# Altium project PSFB.PrjPcb (part 2 of 2)
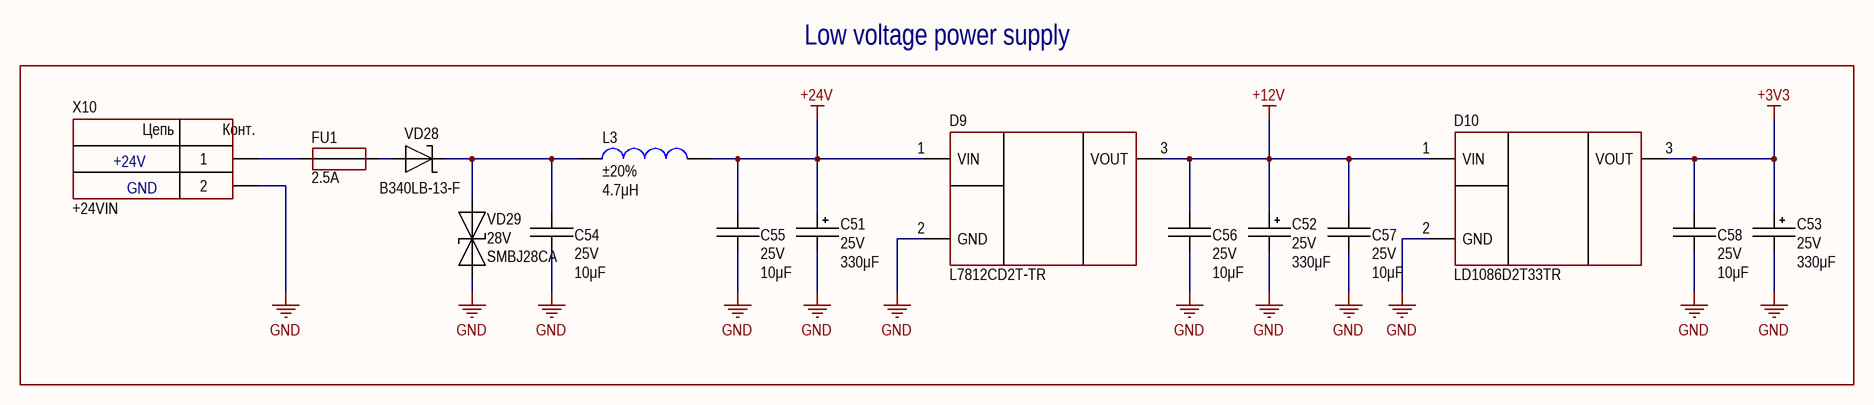
[diagram p6: PSFB_low_voltage_supply.SchDoc]

## Nets that join several sheets
+3V3: PSFB_bus_sense (C2.2 C3.2 D1.2 D2.8), M1 (5 pins), PSFB_low_voltage_supply (C53.1 C58.1 D10.3), M2 (5 pins), M3 (5 pins), M4 (5 pins)
+12V: PSFB_transformer (7 pins), PSFB_low_voltage_supply (5 pins)
+24V: M1 (C9_M1.2 D3_M1.2), PSFB_low_voltage_supply (C51.1 C55.1 D9.1 L3.1), M2 (C9_M2.2 D3_M2.2), M3 (C9_M3.2 D3_M3.2), M4 (C9_M4.2 D3_M4.2)
+VBUS: PSFB_power (T1.7 VD16.2 VT1.2 VT2.2), M2 (VD10_M2.2), M4 (VD10_M4.2)
GND: PSFB_top_level (X11.6 X12.6 X13.6 X14.6), PSFB_bus_sense (11 pins), M1 (13 pins), PSFB_power (C29.2 T1.3), PSFB_transformer (47 pins), PSFB_low_voltage_supply (12 pins), M2 (13 pins), M3 (13 pins), M4 (13 pins)
PGND: PSFB_bus_sense (6 pins), M1 (12 pins), PSFB_power (13 pins), M3 (12 pins)
NetC10_M2_2: M1 (VD10_M1.2), PSFB_power (5 pins), M2 (12 pins)
NetC10_M4_2: PSFB_power (R24.1 VD17.2 VT1.3 VT3.2), PSFB_transformer (T2.2), M3 (VD10_M3.2), M4 (12 pins)
NetC27_2: PSFB_power (C27.2 C28.2 R26.2 R27.2), PSFB_transformer (T2.1)
NetD4_M1_7: M1 (D4_M1.7 R15_M1.2 R18_M1.2), PSFB_power (R30.2 VD18.1 VT4.1)
NetD4_M2_7: PSFB_power (R23.2 VD15.1 VT2.1), M2 (D4_M2.7 R15_M2.2 R18_M2.2)
NetD4_M3_7: PSFB_power (R31.2 VD19.1 VT3.1), M3 (D4_M3.7 R15_M3.2 R18_M3.2)
NetD4_M4_7: PSFB_power (R24.2 VD17.1 VT1.1), M4 (D4_M4.7 R15_M4.2 R18_M4.2)
NetR1_2: PSFB_bus_sense (R1.2), PSFB_power (R28.1 R29.2)
NetR5_2: PSFB_bus_sense (R5.2 VD3.1), PSFB_power (T1.1)
NetR12_M1_1: PSFB_top_level (X13.4), M1 (R12_M1.1)
NetR12_M2_1: PSFB_top_level (X11.4), M2 (R12_M2.1)
NetR12_M3_1: PSFB_top_level (X14.4), M3 (R12_M3.1)
NetR12_M4_1: PSFB_top_level (X12.4), M4 (R12_M4.1)
NetR14_M1_1: PSFB_top_level (X13.5), M1 (R14_M1.1)
NetR14_M2_1: PSFB_top_level (X11.5), M2 (R14_M2.1)
NetR14_M3_1: PSFB_top_level (X14.5), M3 (R14_M3.1)
NetR14_M4_1: PSFB_top_level (X12.5), M4 (R14_M4.1)
NetR16_M1_1: PSFB_top_level (X13.3), M1 (R16_M1.1)
NetR16_M2_1: PSFB_top_level (X11.3), M2 (R16_M2.1)
NetR16_M3_1: PSFB_top_level (X14.3), M3 (R16_M3.1)
NetR16_M4_1: PSFB_top_level (X12.3), M4 (R16_M4.1)
NetR17_M1_1: PSFB_top_level (X11.2 X13.1), M1 (R17_M1.1), M2 (R19_M2.1)
NetR17_M2_1: PSFB_top_level (X11.1 X13.2), M1 (R19_M1.1), M2 (R17_M2.1)
NetR17_M3_1: PSFB_top_level (X12.2 X14.1), M3 (R17_M3.1), M4 (R19_M4.1)
NetR17_M4_1: PSFB_top_level (X12.1 X14.2), M3 (R19_M3.1), M4 (R17_M4.1)